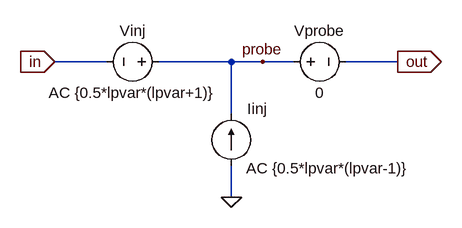
[diagram p0: schematic loop_probe.asc]
loop_probe.asc, the LTspice schematic file:
Version 4
SHEET 1 880 680
WIRE -160 144 -80 144
WIRE 0 144 112 144
WIRE 112 224 112 144
WIRE 112 144 160 144
WIRE 112 352 112 304
WIRE 288 144 368 144
WIRE 160 144 208 144
FLAG 112 352 0
FLAG -160 144 in
IOPIN -160 144 In
FLAG 368 144 out
IOPIN 368 144 Out
FLAG 160 144 probe
SYMBOL current 112 304 M180
WINDOW 0 24 88 Left 0
WINDOW 3 24 0 Left 0
WINDOW 123 23 -4 Left 0
WINDOW 39 0 0 Left 0
SYMATTR InstName Iinj
SYMATTR Value ""
SYMATTR Value2 AC {0.5*lpvar*(lpvar-1)}
SYMBOL voltage 16 144 M270
WINDOW 0 32 56 VTop 0
WINDOW 3 -32 56 VBottom 0
WINDOW 123 -32 56 VBottom 0
WINDOW 39 -32 56 VBottom 0
SYMATTR InstName Vinj
SYMATTR Value ""
SYMATTR Value2 AC {0.5*lpvar*(lpvar+1)}
SYMBOL voltage 192 144 R270
WINDOW 0 32 56 VTop 0
WINDOW 3 -32 56 VBottom 0
WINDOW 123 -32 56 VBottom 0
WINDOW 39 -32 56 VBottom 0
SYMATTR InstName Vprobe
SYMATTR Value 0

The netlist it stands for:
* loop_probe.asc
Iinj 0 probe AC {0.5*lpvar*(lpvar-1)}
Vinj probe in AC {0.5*lpvar*(lpvar+1)}
Vprobe probe out 0
.backanno
.end